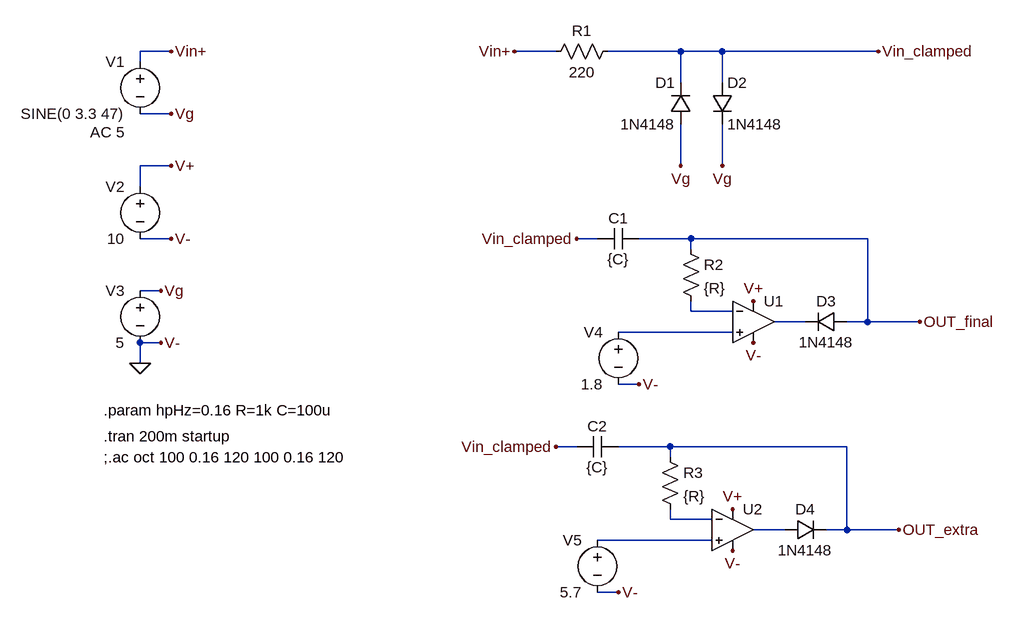
[diagram p0: schematic capstone_clamp.asc]
capstone_clamp.asc, the LTspice schematic file:
Version 4
SHEET 1 1748 696
WIRE -736 -304 -784 -304
WIRE -144 -304 -208 -304
WIRE 48 -304 -64 -304
WIRE 112 -304 48 -304
WIRE 352 -304 112 -304
WIRE -784 -288 -784 -304
WIRE 48 -256 48 -304
WIRE 112 -256 112 -304
WIRE -736 -208 -784 -208
WIRE -736 -128 -784 -128
WIRE 48 -128 48 -192
WIRE 112 -128 112 -192
WIRE -784 -96 -784 -128
WIRE -736 -16 -784 -16
WIRE -80 -16 -112 -16
WIRE 64 -16 -16 -16
WIRE 336 -16 64 -16
WIRE 64 0 64 -16
WIRE -752 64 -784 64
WIRE 64 96 64 80
WIRE 128 96 64 96
WIRE 240 112 192 112
WIRE 336 112 336 -16
WIRE 336 112 304 112
WIRE 416 112 336 112
WIRE 128 128 -48 128
WIRE -752 144 -784 144
WIRE -784 176 -784 144
WIRE -16 208 -48 208
WIRE -112 304 -144 304
WIRE 32 304 -48 304
WIRE 304 304 32 304
WIRE 32 320 32 304
WIRE 32 416 32 400
WIRE 96 416 32 416
WIRE 208 432 160 432
WIRE 304 432 304 304
WIRE 304 432 272 432
WIRE 384 432 304 432
WIRE 96 448 -80 448
WIRE -48 528 -80 528
FLAG -736 -304 Vin+
FLAG -736 -128 V+
FLAG -736 -16 V-
FLAG -736 -208 Vg
FLAG -752 64 Vg
FLAG -208 -304 Vin+
FLAG 352 -304 Vin_clamped
FLAG 160 144 V-
FLAG 160 80 V+
FLAG 416 112 OUT_final
FLAG -16 208 V-
FLAG -752 144 V-
FLAG 48 -128 Vg
FLAG 112 -128 Vg
FLAG -112 -16 Vin_clamped
FLAG -784 176 0
FLAG 128 464 V-
FLAG 128 400 V+
FLAG 384 432 OUT_extra
FLAG -144 304 Vin_clamped
FLAG -48 528 V-
SYMBOL voltage -784 -304 M0
WINDOW 123 24 124 Left 2
WINDOW 39 0 0 Left 0
SYMATTR Value2 AC 5
SYMATTR InstName V1
SYMATTR Value SINE(0 3.3 47)
SYMBOL voltage -784 -112 M0
SYMATTR InstName V2
SYMATTR Value 10
SYMBOL voltage -784 48 M0
SYMATTR InstName V3
SYMATTR Value 5
SYMBOL res -48 -320 R90
WINDOW 0 0 56 VBottom 2
WINDOW 3 32 56 VTop 2
SYMATTR InstName R1
SYMATTR Value 220
SYMBOL diode 64 -192 R180
WINDOW 0 24 64 Left 2
WINDOW 3 24 0 Left 2
SYMATTR InstName D1
SYMATTR Value 1N4148
SYMBOL diode 96 -256 R0
SYMATTR InstName D2
SYMATTR Value 1N4148
SYMBOL Opamps\\UniversalOpamp2 160 112 R0
SYMATTR InstName U1
SYMBOL diode 304 96 R90
WINDOW 0 0 32 VBottom 2
WINDOW 3 32 32 VTop 2
SYMATTR InstName D3
SYMATTR Value 1N4148
SYMBOL res 48 -16 R0
SYMATTR InstName R2
SYMATTR Value {R}
SYMBOL cap -16 -32 R90
WINDOW 0 0 32 VBottom 2
WINDOW 3 32 32 VTop 2
SYMATTR InstName C1
SYMATTR Value {C}
SYMBOL voltage -48 112 M0
SYMATTR InstName V4
SYMATTR Value 1.8
SYMBOL Opamps\\UniversalOpamp2 128 432 R0
SYMATTR InstName U2
SYMBOL diode 208 448 R270
WINDOW 0 32 32 VTop 2
WINDOW 3 0 32 VBottom 2
SYMATTR InstName D4
SYMATTR Value 1N4148
SYMBOL res 16 304 R0
SYMATTR InstName R3
SYMATTR Value {R}
SYMBOL cap -48 288 R90
WINDOW 0 0 32 VBottom 2
WINDOW 3 32 32 VTop 2
SYMATTR InstName C2
SYMATTR Value {C}
SYMBOL voltage -80 432 M0
SYMATTR InstName V5
SYMATTR Value 5.7
TEXT -840 288 Left 2 !.tran 200m startup
TEXT -840 248 Left 2 !.param hpHz=0.16 R=1k C=100u
TEXT -840 320 Left 2 !;.ac oct 100 0.16 120 100 0.16 120

The netlist it stands for:
* capstone_clamp.asc
V1 Vin+ Vg SINE(0 3.3 47) AC 5
V2 V+ 0 10
V3 Vg 0 5
R1 Vin_clamped Vin+ 220
D1 Vg Vin_clamped 1N4148
D2 Vin_clamped Vg 1N4148
XU1 N003 N001 V+ 0 N002 level.2 Avol=1Meg GBW=10Meg Slew=10Meg ilimit=25m rail=0 Vos=0 phimargin=45 en=0 enk=0 in=0 ink=0 Rin=500Meg  ; pins IN+ IN- V+ V- OUT
D3 OUT_final N002 1N4148
R2 OUT_final N001 {R}
C1 OUT_final Vin_clamped {C}
V4 N003 0 1.8
XU2 N006 N004 V+ 0 N005 level.2 Avol=1Meg GBW=10Meg Slew=10Meg ilimit=25m rail=0 Vos=0 phimargin=45 en=0 enk=0 in=0 ink=0 Rin=500Meg  ; pins IN+ IN- V+ V- OUT
D4 N005 OUT_extra 1N4148
R3 OUT_extra N004 {R}
C2 OUT_extra Vin_clamped {C}
V5 N006 0 5.7
.model D D
.lib standard.dio
.tran 200m startup
.param hpHz=0.16 R=1k C=100u
;.ac oct 100 0.16 120 100 0.16 120
.lib UniversalOpamps2.sub
.backanno
.end